# EAGLE design Control de Juez V1.0.0 CNC (EAGLE 9.6.2)
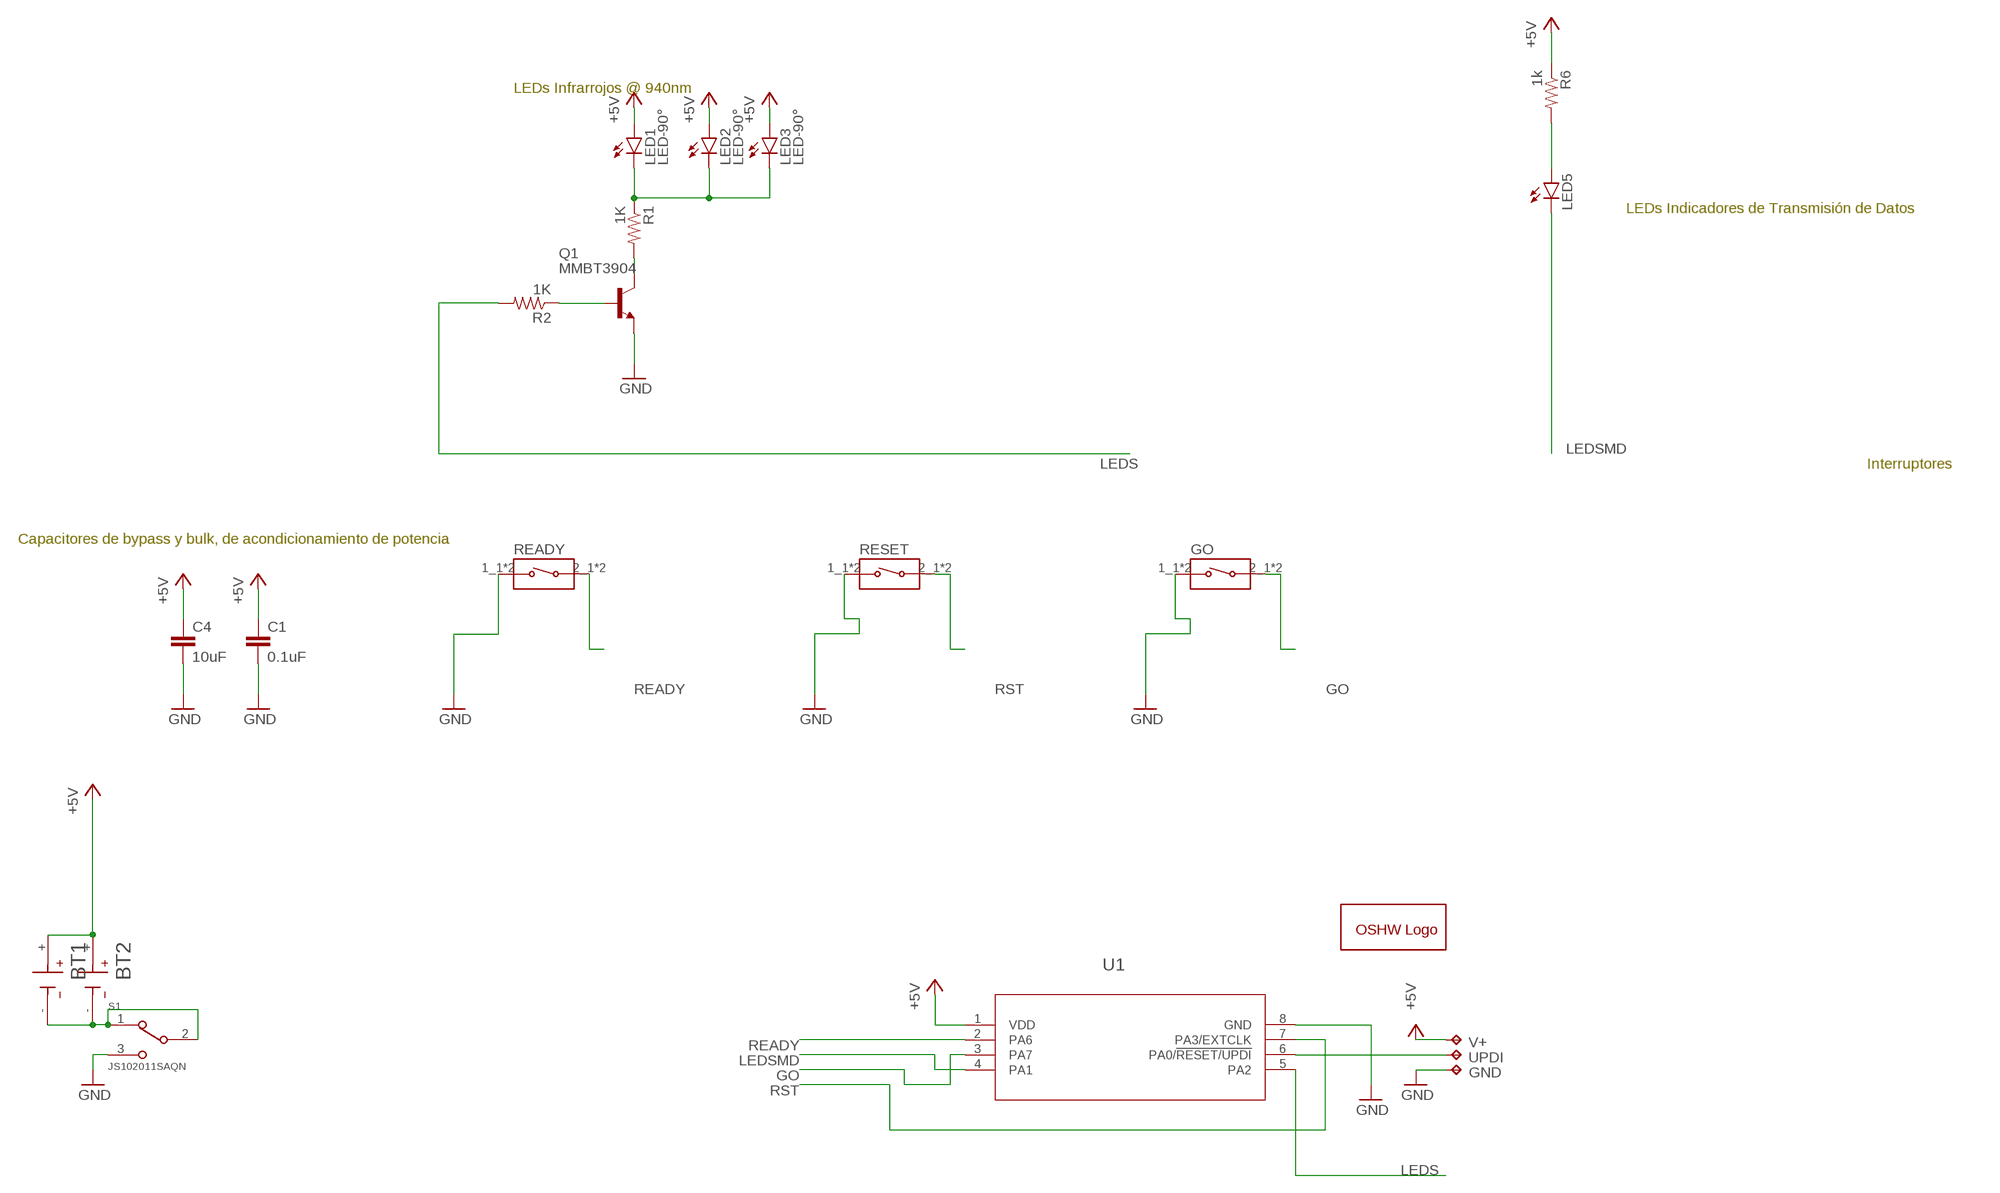
[diagram p0: schematic, sheet 1]

## Parts
BT1  BU2032SM-HD-G  [BAT_BU2032SM-HD-G]
BT2  BU2032SM-HD-G  [BAT_BU2032SM-HD-G]
C1  0.1uF  C-EUC0603  [C0603]
C4  10uF  C-EUC0603  [C0603]
GND  TPB1,27  [B1,27]
GO  EVQ-P7L01P  [SW_EVQ-P7L01P]
GOLD_ORB_SM1  OSHWLOGOLOGO8MM  [OSHW_8MM]
LED1  LED-90°  [LED-90°]
LED2  LED-90°  [LED-90°]
LED3  LED-90°  [LED-90°]
LED5  LEDSML1206  [SML1206]
Q1  MMBT3904  [SOT23]
R1  1K  R-US_R0603  [R0603]
R2  1K  R-US_R0603  [R0603]
R6  1k  R-US_R0603  [R0603]
READY  EVQ-P7L01P  [SW_EVQ-P7L01P]
RESET  EVQ-P7L01P  [SW_EVQ-P7L01P]
S1  JS102011SAQN  [SW_JS102011SAQN]
U1  ATTINY412-SSNSOIC8_SA_SST_MCH-M  [SOIC8_SA_SST_MCH-M]
UPDI  TPB1,27  [B1,27]
V+  TPB1,27  [B1,27]

## Nets
+5V: BT1.+ BT2.+ C1.1 C4.1 LED1.1(A) LED2.1(A) LED3.1(A) R6.1 U1.1(VDD) V+.TP
GND: C1.2 C4.2 GND.TP GO.1_1 GO.1_2 Q1.E READY.1_1 READY.1_2 RESET.1_1 RESET.1_2 S1.3 U1.8(GND)
GO: GO.2_1 GO.2_2 U1.3(PA7)
LEDS: R2.2 U1.5(PA2)
LEDSMD: LED5.C U1.4(PA1)
N$1: U1.6(PA0/!RESET/UPDI) UPDI.TP
N$2: BT1.- BT2.- S1.1 S1.2
N$3: LED1.2(C) LED2.2(C) LED3.2(C) R1.1
N$4: Q1.C R1.2
N$12: Q1.B R2.1
N$14: LED5.A R6.2
READY: READY.2_1 READY.2_2 U1.2(PA6)
RST: RESET.2_1 RESET.2_2 U1.7(PA3/EXTCLK)

## Notes on the sheet
- LEDs Infrarrojos @ 940nm
- LEDs Indicadores de Transmisión de Datos
- Interruptores
- Capacitores de bypass y bulk, de acondicionamiento de potencia

## Library data of the parts
BT1 BT2 = BU2032SM-HD-G:BU2032SM-HD-G: Batt Holder Smt Coin 20mm Tape; DESCRIPTION: BATTERY HOLDER COIN 20MM SMD; MF: MPD (Memory Protection Devices); MP: BU2032SM-HD-G; PACKAGE: None; PURCHASE-URL: https://pricing.snapeda.com/search/part/BU2032SM-HD-G/?ref=eda
C1 C4 = rcl:C-EU: CAPACITOR, European symbol; SPICEPREFIX: C
GND UPDI V+ = testpad:TP: Test pad
GO READY RESET = EVQ-P7L01P:EVQ-P7L01P: Switch Tactile N.O. SPST Rectangular Button Gull Wing 0.05A 12VDC 100000Cycle 1.6N SMD Embossed T/R; DESCRIPTION: Tactile Switch SPST-NO Side Actuated Surface Mount, Right Angle; DIGI-KEY_PART_NUMBER: P16769CT-ND; MF: Panasonic Electronic Components; MP: EVQ-P7L01P; PACKAGE: None; PURCHASE-URL: https://pricing.snapeda.com/search/part/EVQ-P7L01P/?ref=eda
GOLD_ORB_SM1 = oshw:OSHWLOGO: The OSHW logo for PCB layout
LED1-LED3 = LED_TH-90°:LED-90°
LED5 = led:LED: LED OSRAM: - CHIPLED LG R971, LG N971, LY N971, LG Q971, LY Q971, LO R971, LY R971 LH N974, LH R974 LS Q976, LO Q976, LY Q976 LO Q996 - Hyper CHIPLED LW Q18S LB Q993, LB Q99A, LB R99A - SideLED LS A670, LO A670, LY A670, LG A670, LP A670 LB A673, LV A673, LT A673, LW A673 LH A674 LY A675 LS A676, LA A676, LO A676, LY A676, LW A676 LS A679, LY A679, LG A679 - Hyper Micro SIDELED® LS Y876, LA Y876, LO Y876, LY Y876 LT Y87S - SmartLED LW L88C, LW L88S LB L89C, LB L89S, LG L890 LS L89K, LO L89K, LY L89K LS L896, LA L896, LO L896, LY L896 - TOPLED LS T670, LO T670, LY T670, LG T670, LP T670 LSG T670, LSP T670, LSY T670, LOP T670, LYG T670 LG T671, LOG T671, LSG T671 LB T673, LV T673, LT T673, LW T673 LH T674 LS T676, LA T676, LO T676, LY T676, LB T676, LH T676, LSB T676, LW T676 LB T67C, LV T67C, LT T67C, LS T67K, LO T67K, LY T67K, LW E67C LS E67B, LA E67B, LO E67B, LY E67B, LB E67C, LV E67C, LT E67C LW T67C LS T679, LY T679, LG T679 LS T770, LO T770, LY T770, LG T770, LP T770 LB T773, LV T773, LT T773, LW T773 LH T774 LS E675, LA E675, LY E675, LS T675 LS T776, LA T776, LO T776, LY T776, LB T776 LHGB T686 LT T68C, LB T68C - Hyper Mini TOPLED® LB M676 - Mini TOPLED Santana® LG M470 LS M47K, LO M47K, LY M47K Source: http://www.osram.convergy.de LUXEON: - LUMILED® LXK2-PW12-R00, LXK2-PW12-S00, LXK2-PW14-U00, LXK2-PW14-V00 LXK2-PM12-R00, LXK2-PM12-S00, LXK2-PM14-U00 LXK2-PE12-Q00, LXK2-PE12-R00, LXK2-PE12-S00, LXK2-PE14-T00, LXK2-PE14-U00 LXK2-PB12-K00, LXK2-PB12-L00, LXK2-PB12-M00, LXK2-PB14-N00, LXK2-PB14-P00, LXK2-PB14-Q00 LXK2-PR12-L00, LXK2-PR12-M00, LXK2-PR14-Q00, LXK2-PR14-R00 LXK2-PD12-Q00, LXK2-PD12-R00, LXK2-PD12-S00 LXK2-PH12-R00, LXK2-PH12-S00 LXK2-PL12-P00, LXK2-PL12-Q00, LXK2-PL12-R00 Source: www.luxeon.com KINGBRIGHT: KA-3528ASYC Source: www.kingbright.com
Q1 = FAIRCHILD-MMBT3904_Transistor:MMBT3904: FAIRCHILD - MMBT3904 NPN General Purpose Amplifier Description This Device is designed as a general purpose amplifier and switch. The useful dynamic range extends to 100mA as a switch and to 100MHz as an amplifier. Library made By: SOLACE LABS - Applied Research in Motion.
R1 R2 R6 = rcl:R-US_: RESISTOR, American symbol; SPICEPREFIX: R
S1 = JS102011SAQN:JS102011SAQN: JS10 Series SPDT On-On 6 V 0.3 A Gull Wing SMT Slide Switch http://www.snapeda.com/parts/JS102011SAQN/C%26K%20Components/view-part/; DESCRIPTION: Slide Switch SPDT Surface Mount, Right Angle; DIGI-KEY_PART_NUMBER: 401-1999-1-ND; MF: C&K; MP: JS102011SAQN; PACKAGE: None; PURCHASE-URL: https://pricing.snapeda.com/search/part/JS102011SAQN/?ref=eda
U1 = attiny412:ATTINY412-SSN; BUILT_BY: EMA_Molly; COPYRIGHT: Copyright (C) 2018 Accelerated Designs. All rights reserved; MANUFACTURER_PART_NUMBER: ATTINY412-SSN; SOURCELIBRARY: Microchip_2019-08-23_25; VENDOR: Microchip

## Board
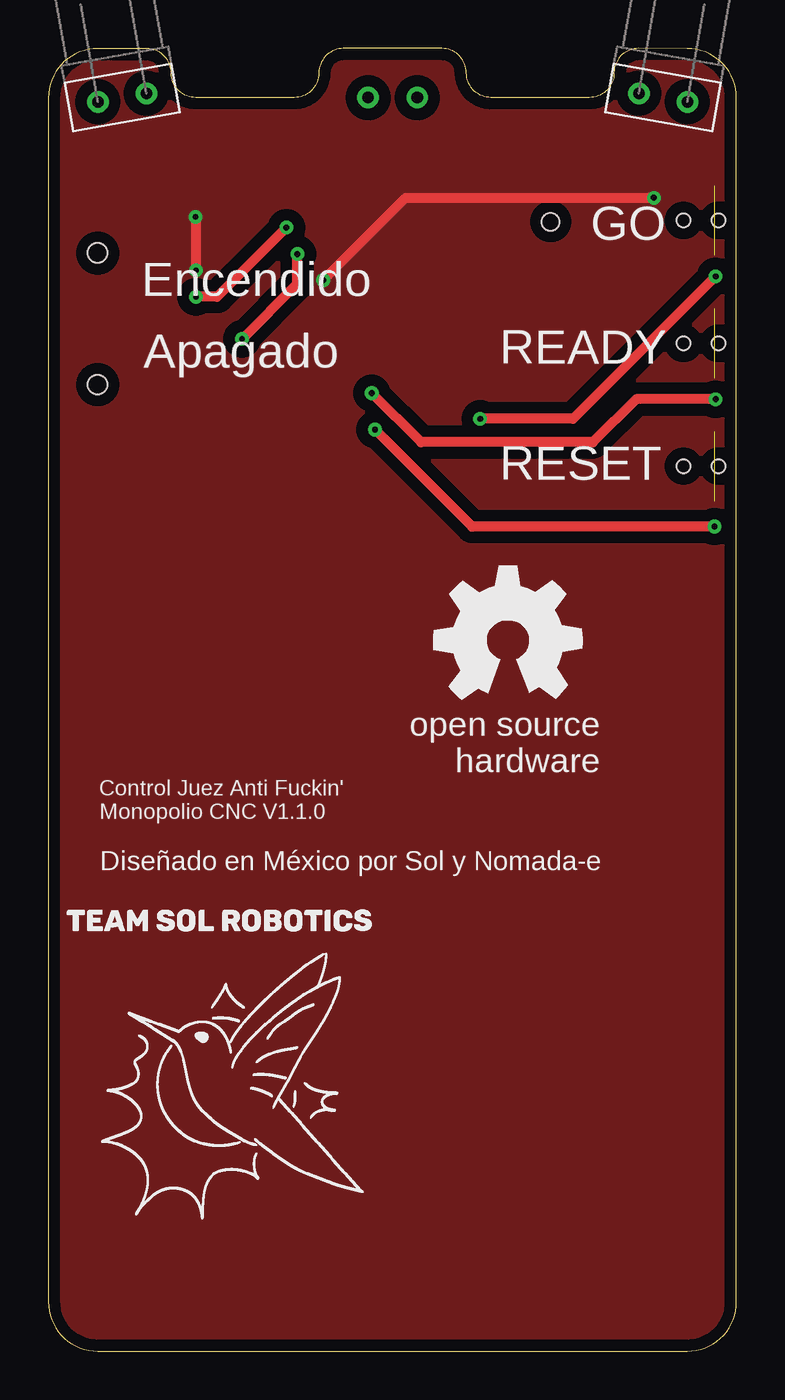
[diagram p1: board, top side]
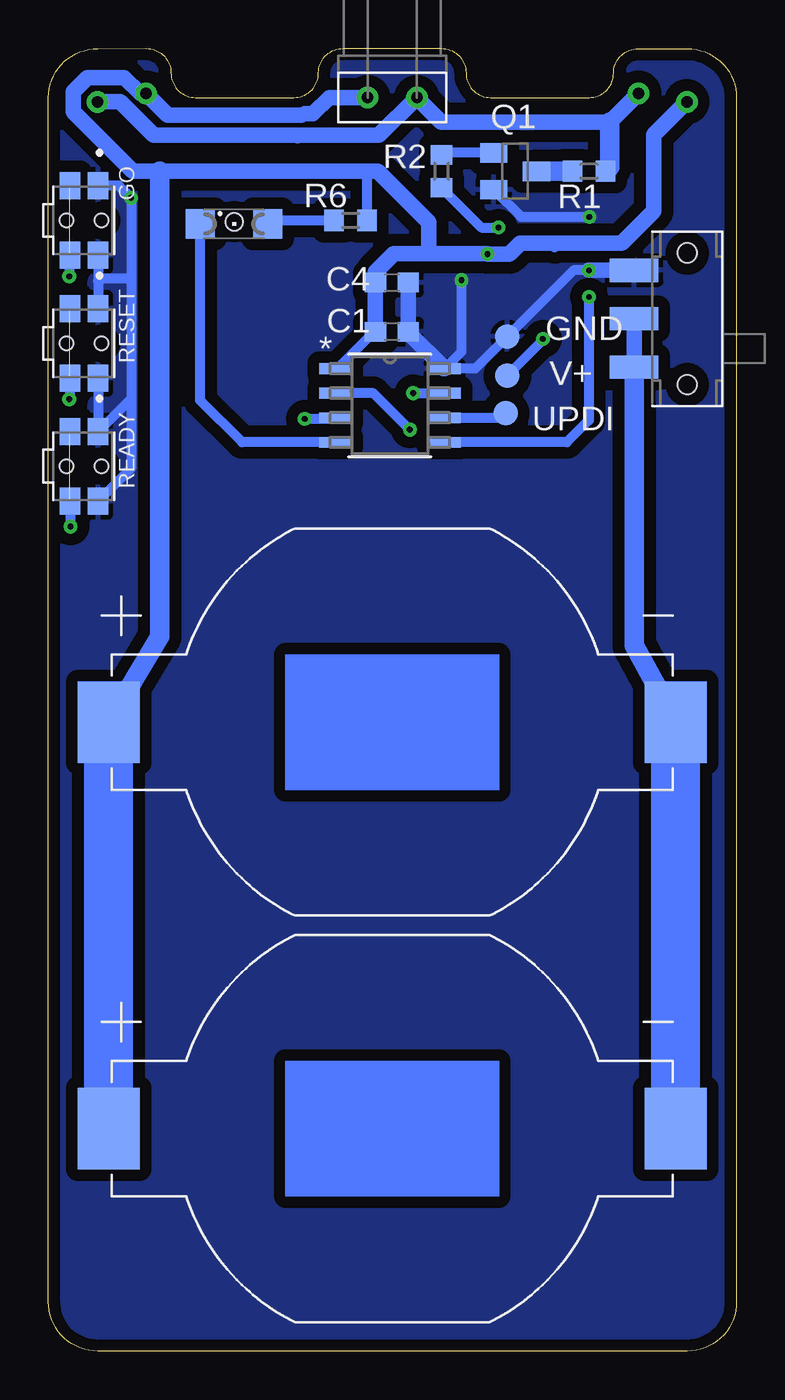
[diagram p2: board, bottom side, seen from below]

Size 35.54 x 67.31 mm. Coordinates in mm from the lower left corner, seen from the top.
Outline: 0,64.76 0,2.54 arc90 2.54,0 33,0 arc90 35.54,2.54 35.54,64.76 arc90 33,67.3 30.48,67.31 arc90 29.21,66.04 arc-90 27.94,64.77 22.86,64.77 arc-90 21.59,66.04 arc90 20.32,67.31 15.24,67.31 arc90 13.97,66.04 arc-90 12.7,64.77 7.61,64.77 arc-90 6.35,66.03 arc90 5.08,67.3 2.54,67.3 arc90 0,64.76
Copper layers (1*16): Top 0.035mm / dielectric 1.5mm / Bottom 0.035mm
Design rules "default *": minimum track width 5mil, minimum drill 0.2mm, track to track 9mil, track to pad 9mil, pad to pad 9mil, via to via 24mil, smd to smd 0mil, copper to edge 20mil, drill to drill 6mil, minimum pad ring 10mil, minimum via ring 8mil, stop-mask expansion 4mil, vias tented up to drill 32mil, thermal gap 10mil
Holes 0.9 mm at 25.94,58.35
vRestrict: area 2.5,34.3 to 10.2,41.9; area 14,34.3 to 21.6,41.9; area 25.4,34.3 to 33,41.9; area 1.3,10.2 to 6.3,20.3; area 8.8,3.7 to 26.8,21.7

### Footprints (pad centres in the part's own frame; a part is rotated, then mirrored left to right if it is on the bottom)
BAT_BU2032SM-HD-G = smd 3.2 x 4.2: + -14.65,0; - 14.65,0
C0603 = smd 1.1 x 1: 1 -0.85,0; 2 0.85,0
B1,27 = smd 1.27 x 1.27: TP 0,0
SW_EVQ-P7L01P = smd 1.4 x 1.05: 1_1 -1.8,0.725; 1_2 1.8,0.725; 2_1 -1.8,-0.725; 2_2 1.8,-0.725 | hole 0.7: 0,0.9; 0,-0.9
LED-90° = drill 0.6: 1 -1.27,0; 2 1.27,0
SML1206 = smd 1.5 x 1.5: A 1.75,0; C -1.75,0
SOT23 = smd 1 x 1.4: B -0.95,-1.1; C 0,1.1; E 0.95,-1.1
R0603 = smd 1 x 1.1: 1 -0.85,0; 2 0.85,0
SW_JS102011SAQN = smd 1.2 x 2.5: 1 -2.5,2.75; 2 0,2.75; 3 2.5,2.75 | hole 1: -3.4,0; 3.4,0
SOIC8_SA_SST_MCH-M = smd 1.655 x 0.558: 1 -2.821,1.905; 2 -2.821,0.635; 3 -2.821,-0.635; 4 -2.821,-1.905; 5 2.821,-1.905; 6 2.821,-0.635; 7 2.821,0.635; 8 2.821,1.905

### Placement (x,y rotation side)
BT1  17.78,11.5 0 bottom
BT2  17.78,32.5 0 bottom
C1  17.8,52.67 0 bottom
C4  17.8,55.21 0 bottom
GND  11.83,52.42 0 bottom
GO  33.7,58.42 270 bottom
GOLD_ORB_SM1  23.71,36.72 0 top
LED1  31.75,64.77 350 top
LED2  17.78,64.77 0 bottom
LED3  3.81,64.77 10 top
LED5  25.95,58.24 0 bottom
Q1  11.43,60.96 270 bottom
R1  7.62,60.96 180 bottom
R2  15.24,60.96 270 bottom
R6  19.93,58.42 180 bottom
READY  33.7,45.72 270 bottom
RESET  33.7,52.07 270 bottom
S1  2.54,53.34 90 bottom
U1  17.9,48.86 0 bottom
UPDI  11.93,48.46 180 bottom
V+  11.83,50.4 0 bottom

### Tracks (layer width: path | path; a pad name or v marks a point on that pad's centre or on a via)
+5V  (via drill 0.3)
  Top 0.508: v10,52.3 12.86,55.16 v12.86,56.68
  Bottom 0.508: 30.49,64.89 LED1.1 | R6.1 19.08,60.96 | 9.2,57.23 9.4,57.03 | U1.1 20.62,50.77 18.72,52.67 | V+.TP 10,52.23 v10,52.3
  Bottom 0.813: 18.72,52.67 C1.1 C4.1 18.65,55.75 17.7,56.7 15.9,56.7 | LED3.1 4.26,62.84 4.26,58.9 5.93,57.23 9.2,57.23 11.17,57.23 11.72,56.68 v12.86,56.68 12.88,56.7 15.9,56.7 | LED2.1 21.03,64.77 21.88,63.92 22.29,63.92 22.44,63.9 22.48,63.86 29.36,63.86 LED1.1 30.8,64.99 31.62,65.81 33.52,65.81 34.26,65.07 34.26,64.03 31.19,60.96 29.8,60.96 19.08,60.96 18.54,60.96 15.9,58.32 15.9,56.7
  Bottom 1.016: BT2.+ 29.8,36.92 29.8,60.96
  Bottom 2.54: BT1.+ BT2.+
GND  (via drill 0.3, 0.3 pad 0.55)
  Top 0.508: v14.2,55.33 18.46,59.59 v31.27,59.59 | v7.6,58.6 7.62,58.58 v7.62,55.84
  Bottom 0.508: Q1.E 11.12,58.6 v7.6,58.6 | v7.62,55.84 8.41,55.84 GND.TP 13.48,50.77 U1.8 14.2,51.64 v14.2,55.33 | GO.1_1 31.9,60.22 v31.27,59.59 31.27,55.4 | GO.1_2 32.98,55.3 | 32.98,55.3 RESET.1_1 | RESET.1_2 READY.1_1 31.27,49.22 | 31.27,55.4 31.27,49.22 | 31.27,55.4 32.88,55.4 32.98,55.3 | 31.27,49.22 31.27,45.62 READY.1_2
  Bottom 0.813: S1.3 v7.62,55.84 | C4.2 C1.2 16.95,52.64 U1.8 15.14,50.77
  pour Bottom (isolate 0.61): 33.02,0 2.54,0 arc-90 0,2.54 0,64.77 arc-90 2.54,67.31 5.08,67.31 arc-90 6.35,66.04 arc90 7.62,64.77 12.7,64.77 arc90 13.97,66.04 arc-90 15.24,67.31 20.32,67.31 arc-90 21.59,66.04 arc90 22.86,64.77 27.94,64.77 arc90 29.21,66.04 arc-90 30.48,67.31 33.02,67.31 arc-90 35.56,64.77 35.56,2.54 arc-90
  pour Top (isolate 0.61): 33.02,0 2.54,0 arc-90 0,2.54 0,64.77 arc-90 2.54,67.31 5.08,67.31 arc-90 6.35,66.04 arc90 7.62,64.77 12.7,64.77 arc90 13.97,66.04 arc-90 15.24,67.31 20.32,67.31 arc-90 21.59,66.04 arc90 22.86,64.77 27.94,64.77 arc90 29.21,66.04 arc-90 30.48,67.31 33.02,67.31 arc-90 35.56,64.77 35.56,2.54 arc-90
GO  (via drill 0.3)  (1 unrouted)
  Top 0.508: v34.46,55.53 27.1,48.17 v22.3,48.17
  Bottom 0.508: GO.2_2 34.46,56.58 v34.46,55.53 | v22.3,48.17 20.77,48.17 U1.3
LEDS  (via drill 0.3)
  Top 0.508: v12.29,58.05 8.71,54.47 v7.62,54.47
  Bottom 0.508: R2.2 13.18,58.05 v12.29,58.05 | U1.5 8.76,46.95 7.62,48.09 v7.62,54.47
LEDSMD
  Bottom 0.508: U1.4 25.54,46.95 27.7,49.12 LED5.C
N$1
  Bottom 0.508: U1.6 12.16,48.23 UPDI.TP
N$2
  Bottom 0.813: S1.2 S1.1
  Bottom 1.016: BT2.- 3.36,32.91 5.29,36.45 S1.1
  Bottom 2.54: BT1.- 3.13,32.69 3.36,32.91
N$3
  Bottom 0.813: LED3.2 6.55,63.5 15.24,63.5 LED2.2 18.47,62.81 22.58,62.81 22.68,62.8 22.71,62.81 30.1,62.81 31.84,64.55 LED1.2
  Bottom 1.016: R1.1 6.55,61.18 6.55,63.5
N$4
  Bottom 1.016: R1.2 Q1.C
N$12
  Bottom 0.508: Q1.B 15.14,61.91 R2.1
N$14
  Bottom 0.508: R6.2 24.02,58.42 LED5.A
READY  (via drill 0.3)  (1 unrouted)
  Top 0.508: v34.4,42.6 21.88,42.6 v16.87,47.61
  Bottom 0.508: READY.2_2 34.4,43.9 v34.4,42.6 | v16.87,47.61 18.75,49.49 U1.2
RST  (via drill 0.3)  (1 unrouted)
  Top 0.508: v34.46,49.18 30.36,49.18 28.13,46.95 19.25,46.95 v16.7,49.5
  Bottom 0.508: RESET.2_2 34.42,49.22 v34.46,49.18 | v16.7,49.5 U1.7

### Text on the board
tNames: GO | Encendido | Apagado | READY | RESET | Control Juez Anti Fuckin' / Monopolio CNC V1.1.0 | Diseñado en México por Sol y Nomada-e